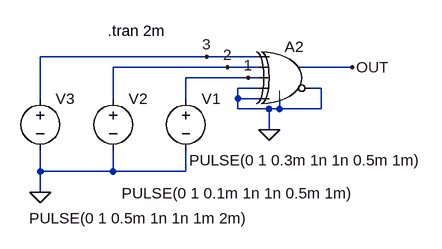
[diagram p0: schematic Fig_2-155_Logic_XOR3.asc]
Fig_2-155_Logic_XOR3.asc, the LTspice schematic file:
Version 4
SHEET 1 880 680
WIRE 80 160 -176 160
WIRE 160 160 80 160
WIRE 112 176 -64 176
WIRE 160 176 112 176
WIRE 304 176 224 176
WIRE 144 192 48 192
WIRE 160 192 144 192
WIRE 160 208 128 208
WIRE 256 208 240 208
WIRE -176 224 -176 160
WIRE -64 224 -64 176
WIRE 48 224 48 192
WIRE 128 224 128 208
WIRE 160 224 128 224
WIRE 128 240 128 224
WIRE 176 240 128 240
WIRE 192 240 192 224
WIRE 192 240 176 240
WIRE 256 240 256 208
WIRE 256 240 192 240
WIRE 176 272 176 240
WIRE -176 336 -176 304
WIRE -64 336 -64 304
WIRE -64 336 -176 336
WIRE 48 336 48 304
WIRE 48 336 -64 336
WIRE -176 368 -176 336
FLAG 176 272 0
FLAG 304 176 OUT
FLAG -176 368 0
FLAG 80 160 3
FLAG 112 176 2
FLAG 144 192 1
SYMBOL voltage 48 208 R0
WINDOW 3 5 111 Left 2
WINDOW 123 0 0 Left 2
WINDOW 39 0 0 Left 2
SYMATTR Value PULSE(0 1 0.3m 1n 1n 0.5m 1m)
SYMATTR InstName V1
SYMBOL voltage -64 208 R0
WINDOW 3 13 162 Left 2
WINDOW 123 0 0 Left 2
WINDOW 39 0 0 Left 2
SYMATTR Value PULSE(0 1 0.1m 1n 1n 0.5m 1m)
SYMATTR InstName V2
SYMBOL Digital\\xor 208 128 R0
SYMATTR InstName A2
SYMBOL voltage -176 208 R0
WINDOW 3 -17 200 Left 2
WINDOW 123 0 0 Left 2
WINDOW 39 0 0 Left 2
SYMATTR Value PULSE(0 1 0.5m 1n 1n 1m 2m)
SYMATTR InstName V3
TEXT -72 120 Left 2 !.tran 2m

The netlist it stands for:
* Fig_2-155_Logic_XOR3.asc
V1 1 0 PULSE(0 1 0.3m 1n 1n 0.5m 1m)
V2 2 0 PULSE(0 1 0.1m 1n 1n 0.5m 1m)
A2 3 2 1 0 0 0 OUT 0 XOR
V3 3 0 PULSE(0 1 0.5m 1n 1n 1m 2m)
.tran 2m
.backanno
.end